# EAGLE schematic M253X (EAGLE 6.6.0)
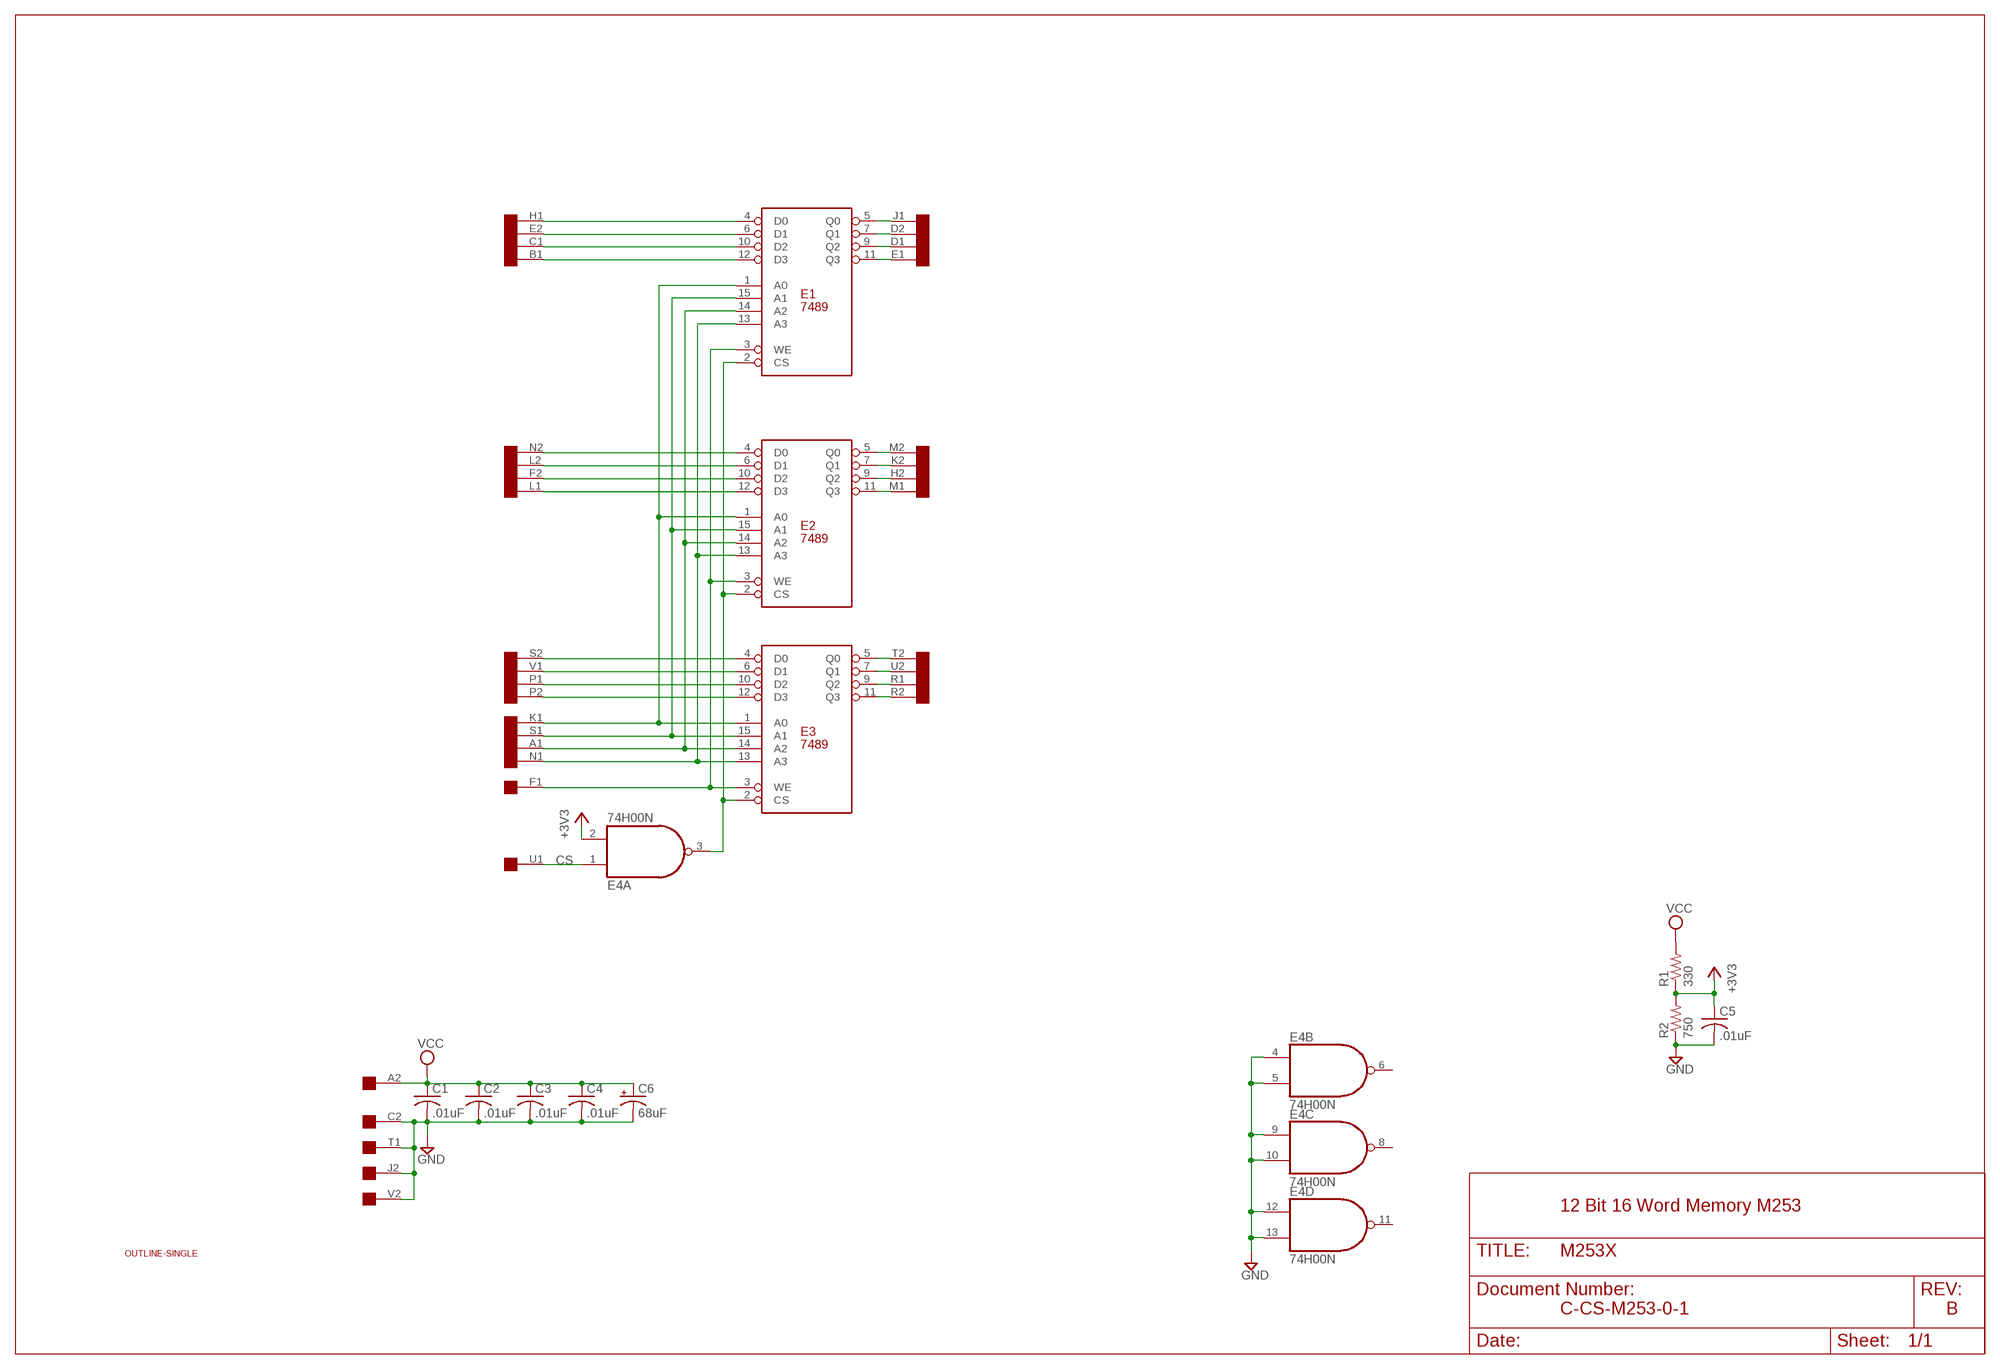
[diagram p0: schematic, sheet 1]

## Parts
C1  .01uF  C-US050-025X075  [C050-025X075]
C2  .01uF  C-US050-025X075  [C050-025X075]
C3  .01uF  C-US050-025X075  [C050-025X075]
C4  .01uF  C-US050-025X075  [C050-025X075]
C5  .01uF  C-US050-025X075  [C050-025X075]
C6  68uF  CPOL-USE25-9AXIAL  [E25-9]
E1  7489  [DIL16]
E2  7489  [DIL16]
E3  7489  [DIL16]
E4  74H00N  74S00N  [DIL14]
R1  330  R-US_0207/10  [0207/10]
R2  750  R-US_0207/10  [0207/10]
U$1  OUTLINE-SINGLE  [SINGLE]
U$2  SINGLE  [EDGE-CON2]

## Nets
+3V3: C5.1 E4.2(A:I1) R1.1 R2.2
CS: E4.1(A:I0) U$2.U1
GND: C1.2 C2.2 C3.2 C4.2 C5.2 C6.- E4.4(B:I0) E4.5(B:I1) E4.9(C:I0) E4.10(C:I1) E4.12(D:I0) E4.13(D:I1) R2.1 U$2.C2 U$2.J2 U$2.T1 U$2.V2
N$1: E1.2(CS) E2.2(CS) E3.2(CS) E4.3(A:O)
N$2: E1.1(A0) E2.1(A0) E3.1(A0) U$2.K1
N$3: E1.14(A2) E2.14(A2) E3.14(A2) U$2.A1
N$4: E1.13(A3) E2.13(A3) E3.13(A3) U$2.N1
N$5: E1.3(WE) E2.3(WE) E3.3(WE) U$2.F1
N$6: E1.15(A1) E2.15(A1) E3.15(A1) U$2.S1
N$7: E1.6(D1) U$2.E2
N$8: E1.4(D0) U$2.H1
N$9: E1.10(D2) U$2.C1
N$10: E1.12(D3) U$2.B1
N$11: E2.6(D1) U$2.L2
N$12: E2.4(D0) U$2.N2
N$13: E2.10(D2) U$2.F2
N$14: E2.12(D3) U$2.L1
N$15: E3.12(D3) U$2.P2
N$16: E3.4(D0) U$2.S2
N$17: E3.10(D2) U$2.P1
N$18: E3.6(D1) U$2.V1
N$19: E1.7(Q1) U$2.D2
N$20: E1.5(Q0) U$2.J1
N$21: E1.11(Q3) U$2.E1
N$22: E1.9(Q2) U$2.D1
N$23: E2.5(Q0) U$2.M2
N$24: E2.7(Q1) U$2.K2
N$25: E2.9(Q2) U$2.H2
N$26: E2.11(Q3) U$2.M1
N$27: E3.11(Q3) U$2.R2
N$28: E3.5(Q0) U$2.T2
N$29: E3.7(Q1) U$2.U2
N$30: E3.9(Q2) U$2.R1
VCC: C1.1 C2.1 C3.1 C4.1 C6.+ R1.2 U$2.A2
Unconnected: E4.6(B:O) E4.8(C:O) E4.11(D:O) U$2.B2

## Notes on the sheet
- 12 Bit 16 Word Memory M253
- C-CS-M253-0-1 | B

## Power pins joined to a net without a drawn wire
GND: E1.8(GND) E2.8(GND) E3.8(GND) E4.7(P:GND)
VCC: E1.16(VCC) E2.16(VCC) E3.16(VCC) E4.14(P:VCC)

## Library data of the parts
C1-C5 = rcl:C-US: CAPACITOR, American symbol
C6 = rcl:CPOL-US: POLARIZED CAPACITOR, American symbol
E1-E3 = dec-con:74*89: 16x4 Memory
E4 = 74xx-us:74*00: Quad 2-input NAND gate
R1 R2 = rcl:R-US_: RESISTOR, American symbol
U$1 = dec-con:OUTLINE-*: Board outlines for DEC boards.
U$2 = dec-con:SINGLE: Single-Height DEC board

## Net classes
0 default: width 0.813 mm